# EAGLE design indicator-4x3-chain-v1 (EAGLE 7.7.0)
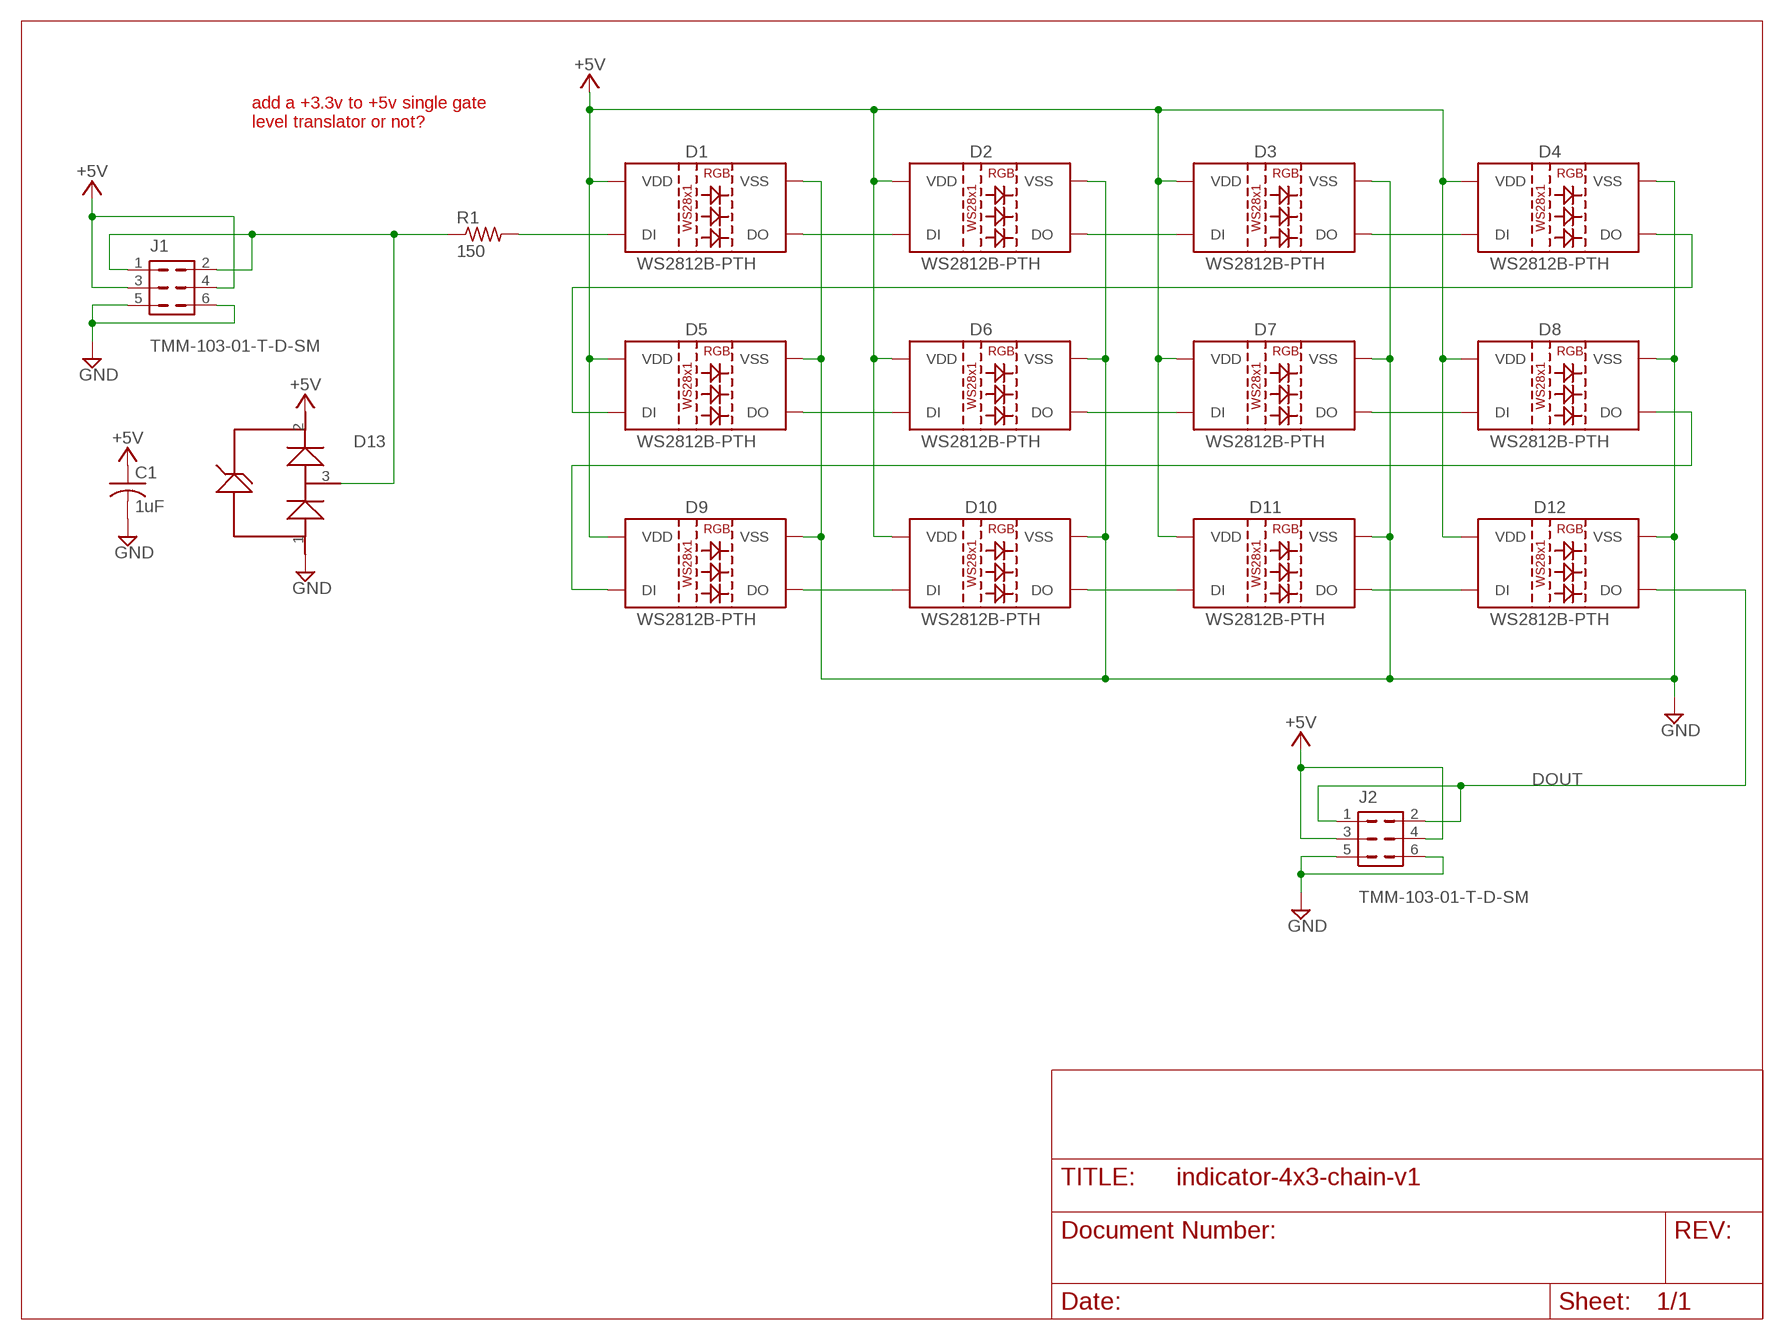
[diagram p0: schematic, sheet 1]

## Parts
C1  1uF  C-USC0603K  [C0603K]
D1  WS2812B-PTH  [WS2812B-PTH-KIT]
D2  WS2812B-PTH  [WS2812B-PTH-KIT]
D3  WS2812B-PTH  [WS2812B-PTH-KIT]
D4  WS2812B-PTH  [WS2812B-PTH-KIT]
D5  WS2812B-PTH  [WS2812B-PTH-KIT]
D6  WS2812B-PTH  [WS2812B-PTH-KIT]
D7  WS2812B-PTH  [WS2812B-PTH-KIT]
D8  WS2812B-PTH  [WS2812B-PTH-KIT]
D9  WS2812B-PTH  [WS2812B-PTH-KIT]
D10  WS2812B-PTH  [WS2812B-PTH-KIT]
D11  WS2812B-PTH  [WS2812B-PTH-KIT]
D12  WS2812B-PTH  [WS2812B-PTH-KIT]
D13  DRTR5V0U1SO  [SOT23-3]
J1  TMM-103-01-T-D-SM  [2MM-SMD-HEADER-2X3]
J2  TMM-103-01-T-D-SM  [2MM-SMD-HEADER-2X3]
R1  150  R-US_R0603  [R0603]

## Nets
+5V: C1.1 D1.2(VDD) D2.2(VDD) D3.2(VDD) D4.2(VDD) D5.2(VDD) D6.2(VDD) D7.2(VDD) D8.2(VDD) D9.2(VDD) D10.2(VDD) D11.2(VDD) D12.2(VDD) D13.2 J1.3 J1.4 J2.3 J2.4
DIN: D13.3 J1.1 J1.2 R1.1
DOUT: D12.4(DO) J2.1 J2.2
GND: C1.2 D1.3(VSS) D2.3(VSS) D3.3(VSS) D4.3(VSS) D5.3(VSS) D6.3(VSS) D7.3(VSS) D8.3(VSS) D9.3(VSS) D10.3(VSS) D11.3(VSS) D12.3(VSS) D13.1 J1.5 J1.6 J2.5 J2.6
N$2: D5.4(DO) D6.1(DI)
N$3: D6.4(DO) D7.1(DI)
N$4: D1.4(DO) D2.1(DI)
N$5: D2.4(DO) D3.1(DI)
N$6: D3.4(DO) D4.1(DI)
N$7: D7.4(DO) D8.1(DI)
N$8: D4.4(DO) D5.1(DI)
N$9: D9.4(DO) D10.1(DI)
N$10: D10.4(DO) D11.1(DI)
N$11: D11.4(DO) D12.1(DI)
N$12: D1.1(DI) R1.2
N$15: D8.4(DO) D9.1(DI)

## Notes on the sheet
- add a +3.3v to +5v single gate
  level translator or not?

## Library data of the parts
C1 = rcl:C-US: CAPACITOR, American symbol
D1-D12 = SparkFun-LED:WS2812B-PTH: WS2812B PTH addressable RGB LED 5mm PTH LED with built-in controller IC. Color: Red/Green/Blue mC Rating: RGB: 390, 660, 180 mcd Forward Voltage: RGB: 2.0, 3.0, 3.0 V SparkFun Products: LED - RGB Addressable, PTH, 5mm Diffused (5 Pack) <https://www.sparkfun.com/products/12986> LED - RGB Addressable, PTH, 5mm Clear (5 Pack) <https://www.sparkfun.com/products/12999> Datasheet referenced for footprint: WS2812B-PTH <https://cdn.sparkfun.com/datasheets/Components/LED/COM-12877.pdf>
D13 = GlenPartsLibrary:DRTR5V0U1SO; MFR: DIODES INC; MFR_PART_NO: DRTR5V0U1SO
J1 J2 = GlenPartsLibrary:TMM-103-01-T-D-SM
R1 = rcl:R-US_: RESISTOR, American symbol

## Board
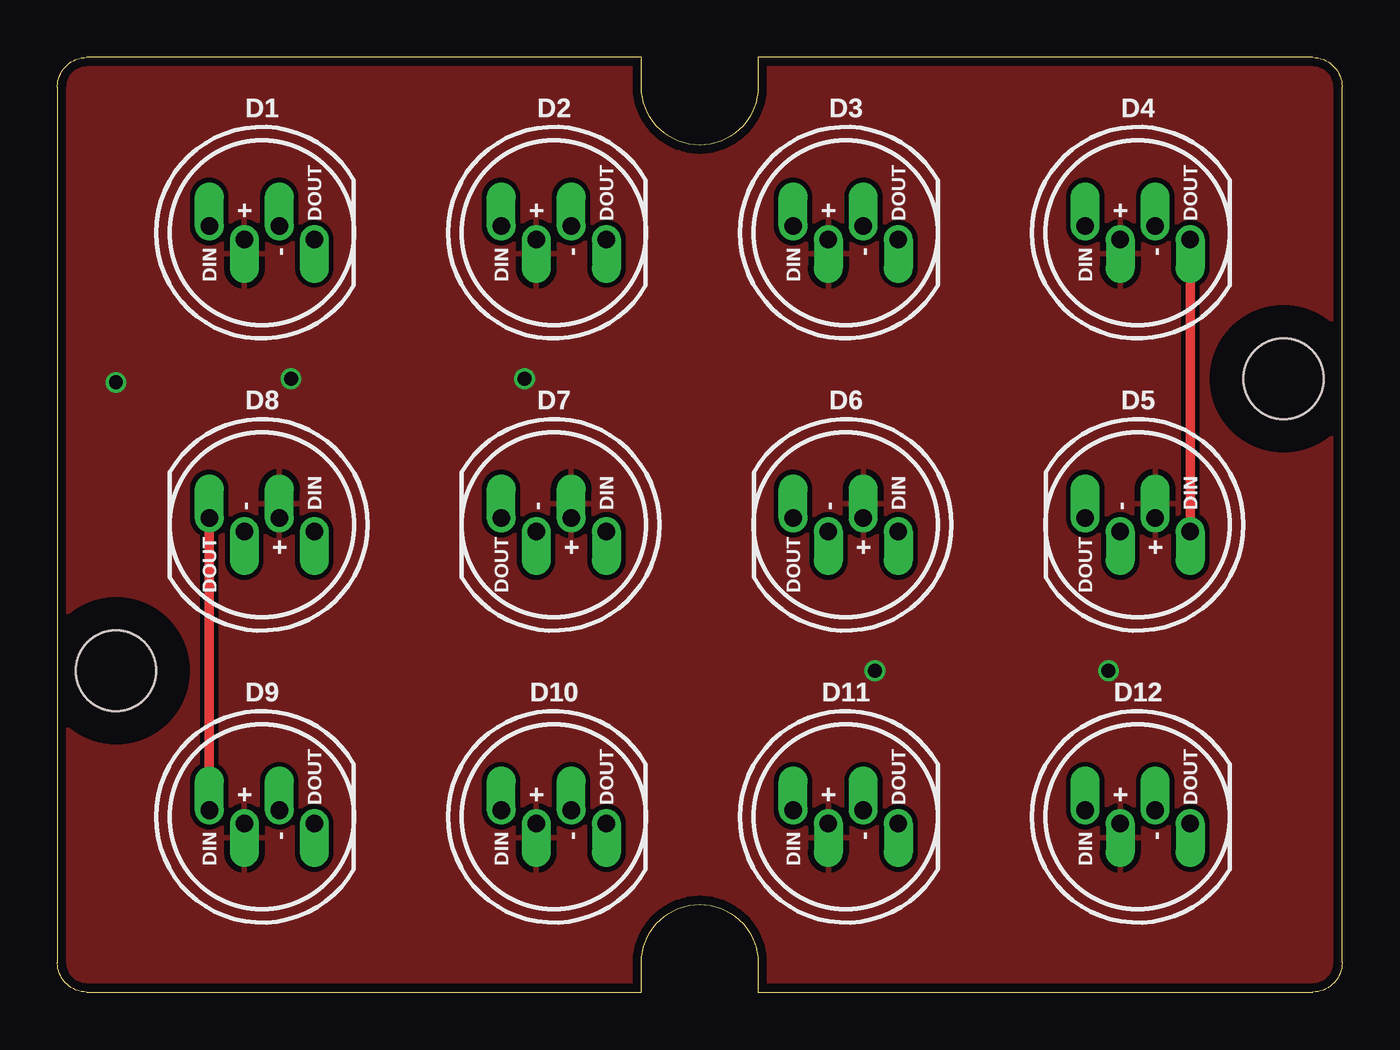
[diagram p1: board, top side]
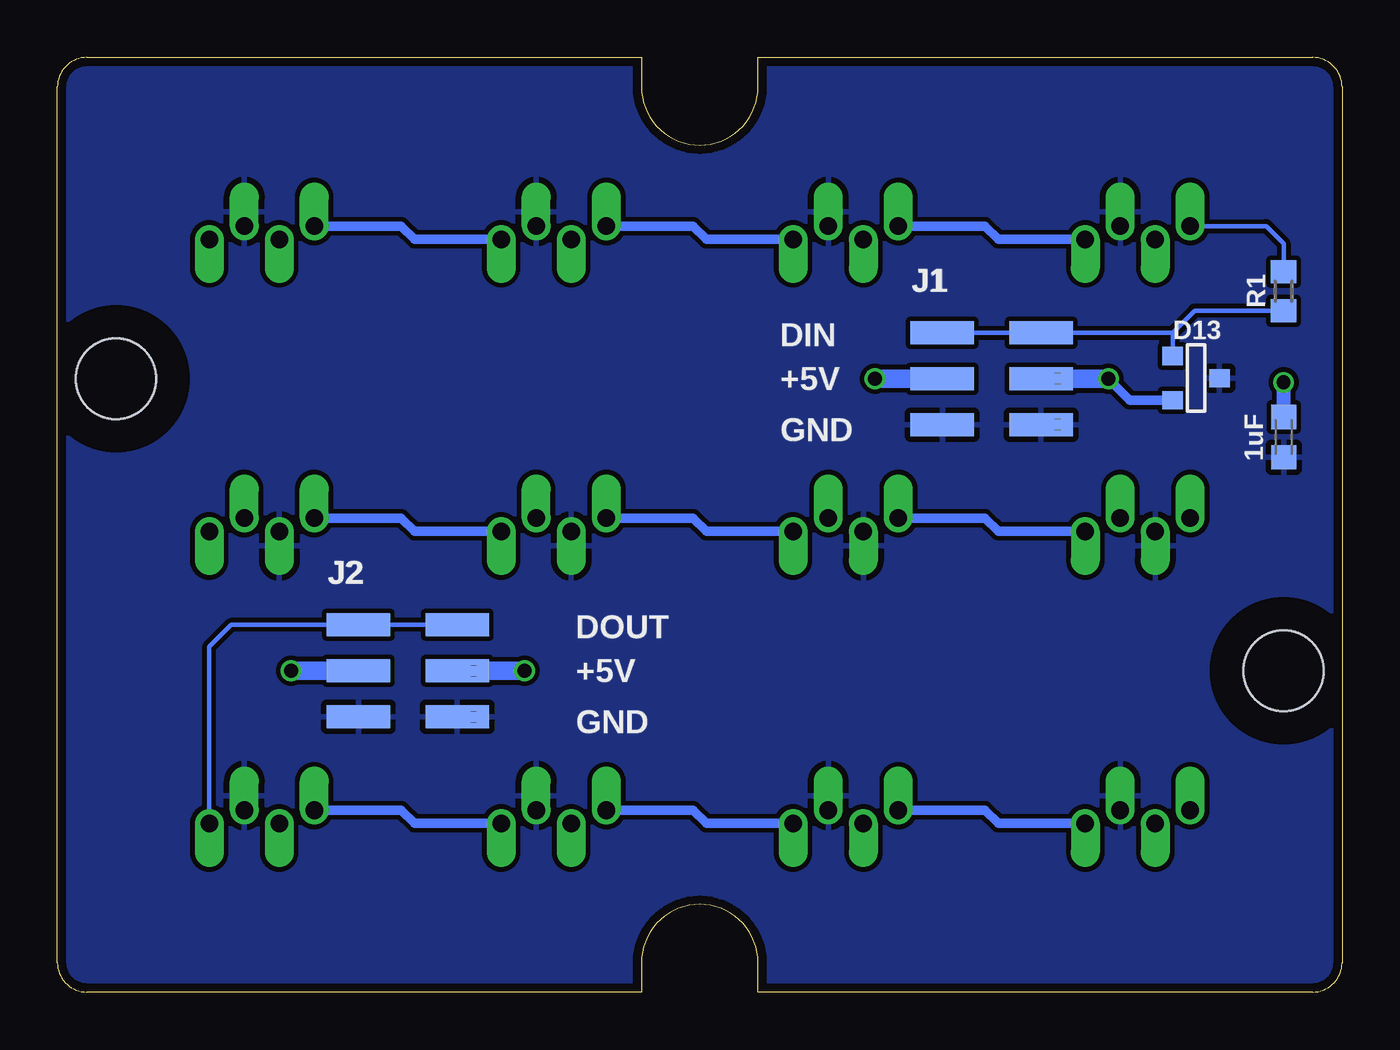
[diagram p2: board, bottom side, seen from below]

Size 55.88 x 40.64 mm. Coordinates in mm from the lower left corner, seen from the top.
Outline: 1.27,0 25.4,0 25.4,1.27 arc-90 27.94,3.81 arc-90 30.48,1.27 30.48,0 54.61,0 arc90 55.88,1.27 55.88,39.37 arc90 54.61,40.64 30.48,40.64 30.48,39.37 arc-90 27.94,36.83 arc-90 25.4,39.37 25.4,40.64 1.27,40.64 arc90 0,39.37 0,1.27 arc90 1.27,0
Copper layers (1*16): Top 0.035559375mm / dielectric 1.6mm / Bottom 0.035559375mm
Design rules "oshpark-2layer-2018": minimum track width 6mil, minimum drill 10mil, track to track 6mil, track to pad 6mil, pad to pad 6mil, via to via 6mil, smd to smd 6mil, copper to edge 15mil, drill to drill 6mil, minimum pad ring 5mil, minimum via ring 5mil, stop-mask expansion 2.5mil, vias tented up to drill 0mil, thermal gap 10mil
Holes 3.5 mm at 2.54,13.97 53.34,26.67
tRestrict: area -0.5,11 to 5.5,17; area 50.3,23.7 to 56.3,29.7
bRestrict: area 50.3,23.7 to 56.3,29.7; area -0.5,11 to 5.5,17

### Footprints (pad centres in the part's own frame; a part is rotated, then mirrored left to right if it is on the bottom)
C0603K = smd 1.05 x 1.08: 1 -0.875,0; 2 0.875,0
WS2812B-PTH-KIT = drill 0.762 pad 1.27 offset: 1 2.286,-0.286; 2 0.762,0.286; 3 -0.762,-0.286; 4 -2.286,0.286
SOT23-3 = smd 0.889 x 0.787: 1 1.016,0.025; 2 -1.016,-0.94; 3 -1.016,0.991
2MM-SMD-HEADER-2X3 = smd 1 x 2.75: 1 -2,-2.15; 2 -2,2.15; 3 0,-2.15; 4 0,2.15; 5 2,-2.15; 6 2,2.15
R0603 = smd 1 x 1.1: 1 -0.85,0; 2 0.85,0

### Placement (x,y rotation side)
C1  2.54,24.13 270 bottom
D1  8.89,33.02 180 top
D2  21.59,33.02 180 top
D3  34.29,33.02 180 top
D4  46.99,33.02 180 top
D5  46.99,20.32 0 top
D6  34.29,20.32 0 top
D7  21.59,20.32 0 top
D8  8.89,20.32 0 top
D9  8.89,7.62 180 top
D10  21.59,7.62 180 top
D11  34.29,7.62 180 top
D12  46.99,7.62 180 top
D13  6.35,26.67 0 bottom
J1  15.24,26.67 270 bottom
J2  40.64,13.97 270 bottom
R1  2.54,30.48 90 bottom

### Tracks (layer width: path | path; a pad name or v marks a point on that pad's centre or on a via)
+5V  (via drill 0.6)
  Bottom 0.406: D13.2 9.22,25.73 v10.16,26.67
  Bottom 0.61: C1.1 v2.54,26.51
  Bottom 0.813: J1.4 v10.16,26.67 | J1.3 v20.32,26.67 | J2.3 v45.72,13.97 | J2.4 v35.56,13.97
  pour Top (isolate 0.203): 0,40.64 55.88,40.64 55.88,0 0,0
DIN
  Bottom 0.203: J1.1 J1.2 7.37,28.67 | 7.37,28.67 6.41,29.63 R1.1 | D13.3 7.37,28.67 | 7.37,28.67
DOUT
  Bottom 0.203: J2.2 J2.1 48.32,15.97 49.28,15.02 D12.4
GND
  pour Bottom (isolate 0.203): 0,0 55.88,0 55.88,40.64 0,40.64
N$2
  Bottom 0.406: D6.1 40.35,20.03 40.93,20.61 D5.4
N$3
  Bottom 0.406: D7.1 27.65,20.03 28.23,20.61 D6.4
N$4
  Bottom 0.406: D1.4 14.95,32.73 15.53,33.31 D2.1
N$5
  Bottom 0.406: D2.4 27.65,32.73 28.23,33.31 D3.1
N$6
  Bottom 0.406: D3.4 40.35,32.73 40.93,33.31 D4.1
N$7
  Bottom 0.406: D8.1 14.95,20.03 15.53,20.61 D7.4
N$8
  Top 0.406: D4.4 D5.1
N$9
  Bottom 0.406: D9.4 14.95,7.33 15.53,7.91 D10.1
N$10
  Bottom 0.406: D10.4 27.65,7.33 28.23,7.91 D11.1
N$11
  Bottom 0.406: D11.4 40.35,7.33 40.93,7.91 D12.1
N$12
  Bottom 0.203: D1.1 3.3,33.31 2.54,32.54 R1.2
N$15
  Top 0.406: D8.4 D9.1

### Text on the board
_tsilk: D1 | D2 | D3 | D4 | + | DOUT | + | DOUT | + | DOUT | + | DOUT | DIN | - | DIN | - | DIN | - | DIN | - | D8 | D7 | D6 | D5 | - | DIN | - | DIN | - | DIN | - | DIN | DOUT | + | DOUT | + | DOUT | + | DOUT | + | D9 | D10 | D11 | D12 | + | DOUT | + | DOUT | + | DOUT | + | DOUT | DIN | - | DIN | - | DIN | - | DIN | -
_bsilk: J1 | DIN | +5V | GND | J2 | DOUT | +5V | GND